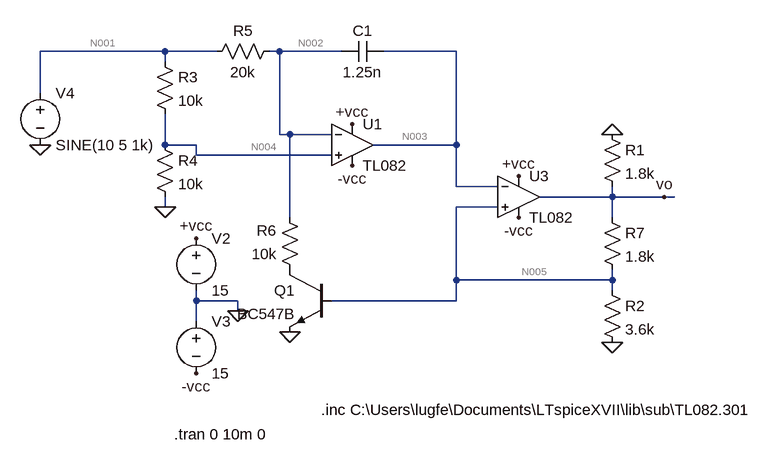
[diagram p0: schematic Draft4.asc]
Draft4.asc, the LTspice schematic file:
Version 4
SHEET 1 880 680
WIRE -384 48 -576 48
WIRE -304 48 -384 48
WIRE -208 48 -224 48
WIRE -112 48 -208 48
WIRE 64 48 -48 48
WIRE -384 64 -384 48
WIRE -576 112 -576 48
WIRE -208 176 -208 48
WIRE -192 176 -208 176
WIRE -128 176 -192 176
WIRE -384 192 -384 144
WIRE -336 192 -384 192
WIRE 64 192 64 48
WIRE 64 192 -64 192
WIRE -336 208 -336 192
WIRE -128 208 -336 208
WIRE 64 256 64 192
WIRE 128 256 64 256
WIRE 304 272 304 256
WIRE 304 272 192 272
WIRE 384 272 304 272
WIRE 400 272 384 272
WIRE -384 288 -384 272
WIRE 128 288 64 288
WIRE -192 304 -192 176
WIRE 304 304 304 272
WIRE 64 400 64 288
WIRE 304 400 304 384
WIRE 304 400 64 400
WIRE 304 416 304 400
WIRE -336 432 -336 416
WIRE -272 432 -336 432
WIRE 64 432 64 400
WIRE 64 432 -128 432
WIRE -272 448 -272 432
WIRE -336 464 -336 432
FLAG -272 448 0
FLAG -336 544 -vcc
FLAG -336 336 +vcc
FLAG 160 240 +vcc
FLAG 304 496 0
FLAG 384 272 vo
FLAG 160 304 -vcc
FLAG -576 192 0
FLAG -384 288 0
FLAG -192 480 0
FLAG -96 160 +vcc
FLAG -96 224 -vcc
FLAG 304 176 0
SYMBOL Opamps\\opamp2 160 208 R0
SYMATTR InstName U3
SYMATTR Value TL082
SYMBOL voltage -336 320 R0
WINDOW 123 0 0 Left 0
WINDOW 39 0 0 Left 0
SYMATTR InstName V2
SYMATTR Value 15
SYMBOL voltage -336 448 R0
WINDOW 123 0 0 Left 0
WINDOW 39 0 0 Left 0
SYMATTR InstName V3
SYMATTR Value 15
SYMBOL res 288 400 R0
SYMATTR InstName R2
SYMATTR Value 3.6k
SYMBOL voltage -576 96 R0
WINDOW 123 24 124 Left 2
WINDOW 39 0 0 Left 0
SYMATTR InstName V4
SYMATTR Value SINE(10 5 1k)
SYMBOL Opamps\\opamp2 -96 128 R0
SYMATTR InstName U1
SYMATTR Value TL082
SYMBOL cap -48 32 R90
WINDOW 0 0 32 VBottom 2
WINDOW 3 32 32 VTop 2
SYMATTR InstName C1
SYMATTR Value 1.25n
SYMBOL res -400 48 R0
SYMATTR InstName R3
SYMATTR Value 10k
SYMBOL res -400 176 R0
SYMATTR InstName R4
SYMATTR Value 10k
SYMBOL res -208 32 R90
WINDOW 0 0 56 VBottom 2
WINDOW 3 32 56 VTop 2
SYMATTR InstName R5
SYMATTR Value 20k
SYMBOL res -176 400 R180
WINDOW 0 36 76 Left 2
WINDOW 3 36 40 Left 2
SYMATTR InstName R6
SYMATTR Value 10k
SYMBOL npn -128 384 M0
SYMATTR InstName Q1
SYMATTR Value BC547B
SYMBOL res 288 160 R0
SYMATTR InstName R1
SYMATTR Value 1.8k
SYMBOL res 288 288 R0
SYMATTR InstName R7
SYMATTR Value 1.8k
TEXT -370 638 Left 2 !.tran 0 10m 0
TEXT -144 600 Left 2 !.inc C:\\Users\\lugfe\\Documents\\LTspiceXVII\\lib\\sub\\TL082.301

The netlist it stands for:
* Draft4.asc
XU3 N005 N003 +vcc -vcc vo TL082  ; pins In+ In- V+ V- OUT
V2 +vcc 0 15
V3 0 -vcc 15
R2 N005 0 3.6k
V4 N001 0 SINE(10 5 1k)
XU1 N004 N002 +vcc -vcc N003 TL082  ; pins In+ In- V+ V- OUT
C1 N003 N002 1.25n
R3 N001 N004 10k
R4 N004 0 10k
R5 N002 N001 20k
R6 P001 N002 10k
Q1 P001 N005 0 0 BC547B
R1 0 vo 1.8k
R7 vo N005 1.8k
.model NPN NPN
.model PNP PNP
.lib standard.bjt
.tran 0 10m 0
.inc C:\Users\lugfe\Documents\LTspiceXVII\lib\sub\TL082.301
.backanno
.end

* Results of the author's LTspice run, read from the files saved beside the schematic
* Operating Point, zero values left out:
*   V(vo) = 903.8 mV
*   V(-vcc) = -15 V
*   V(+vcc) = 15 V
*   V(n003) = 601.5 mV
*   V(n005) = 601.5 mV
*   V(n001) = 10 V
*   V(n002) = 5 V
*   V(n004) = 5 V
*   V(p001) = 2.5 V
*   Ic(Q1) = 250 µA
*   Ib(Q1) = 857.9 nA
*   Ie(Q1) = -250.9 µA
*   I(R7) = 167.9 µA
*   I(R1) = -502.1 µA
*   I(R6) = -250 µA
*   I(R5) = -250 µA
*   I(R4) = 500 µA
*   I(R3) = 500 µA
*   I(R2) = 167.1 µA
*   I(V4) = -750 µA
*   I(V3) = -28.38 mA
*   I(V2) = -28.39 mA
*   Ix(u3:1) = 45.66 pA
*   Ix(u3:2) = 45.66 pA
*   Ix(u3:3) = 14.19 mA
*   Ix(u3:4) = -14.19 mA
*   Ix(u3:5) = -670 µA
*   Ix(u1:1) = 50.07 pA
*   Ix(u1:2) = 50.07 pA
*   Ix(u1:3) = 14.19 mA
*   Ix(u1:4) = -14.19 mA
*   Ix(u1:5) = -45.66 pA
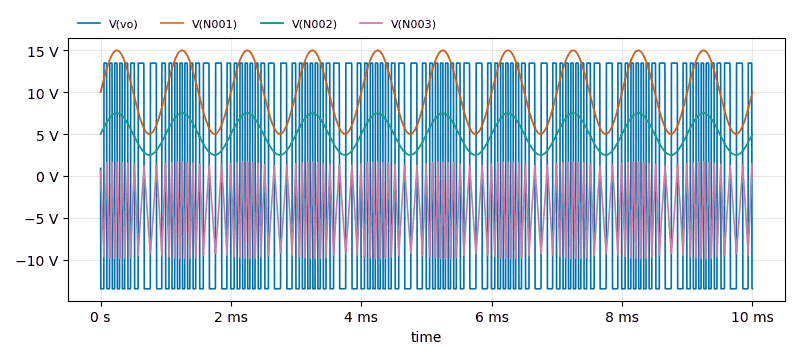
[diagram p1: Transient Analysis of Draft4.asc, plotted from the saved traces]
* Transient Analysis, 1 run:
*   V(vo): min -13.48 V, max 13.5 V, average 56.53 mV, rms 13.27 V, last -13.48 V
*   V(N001): min 5 V, max 15 V, average 10 V, rms 10.61 V, last 10 V
*   V(N002): min 2.472 V, max 7.568 V, average 5.001 V, rms 5.304 V, last 5.009 V
*   V(N003): min -9.843 V, max 1.649 V, average -4.061 V, rms 5.21 V, last -191.2 mV